# EAGLE design fakugesi_pass (EAGLE 7.5.0)
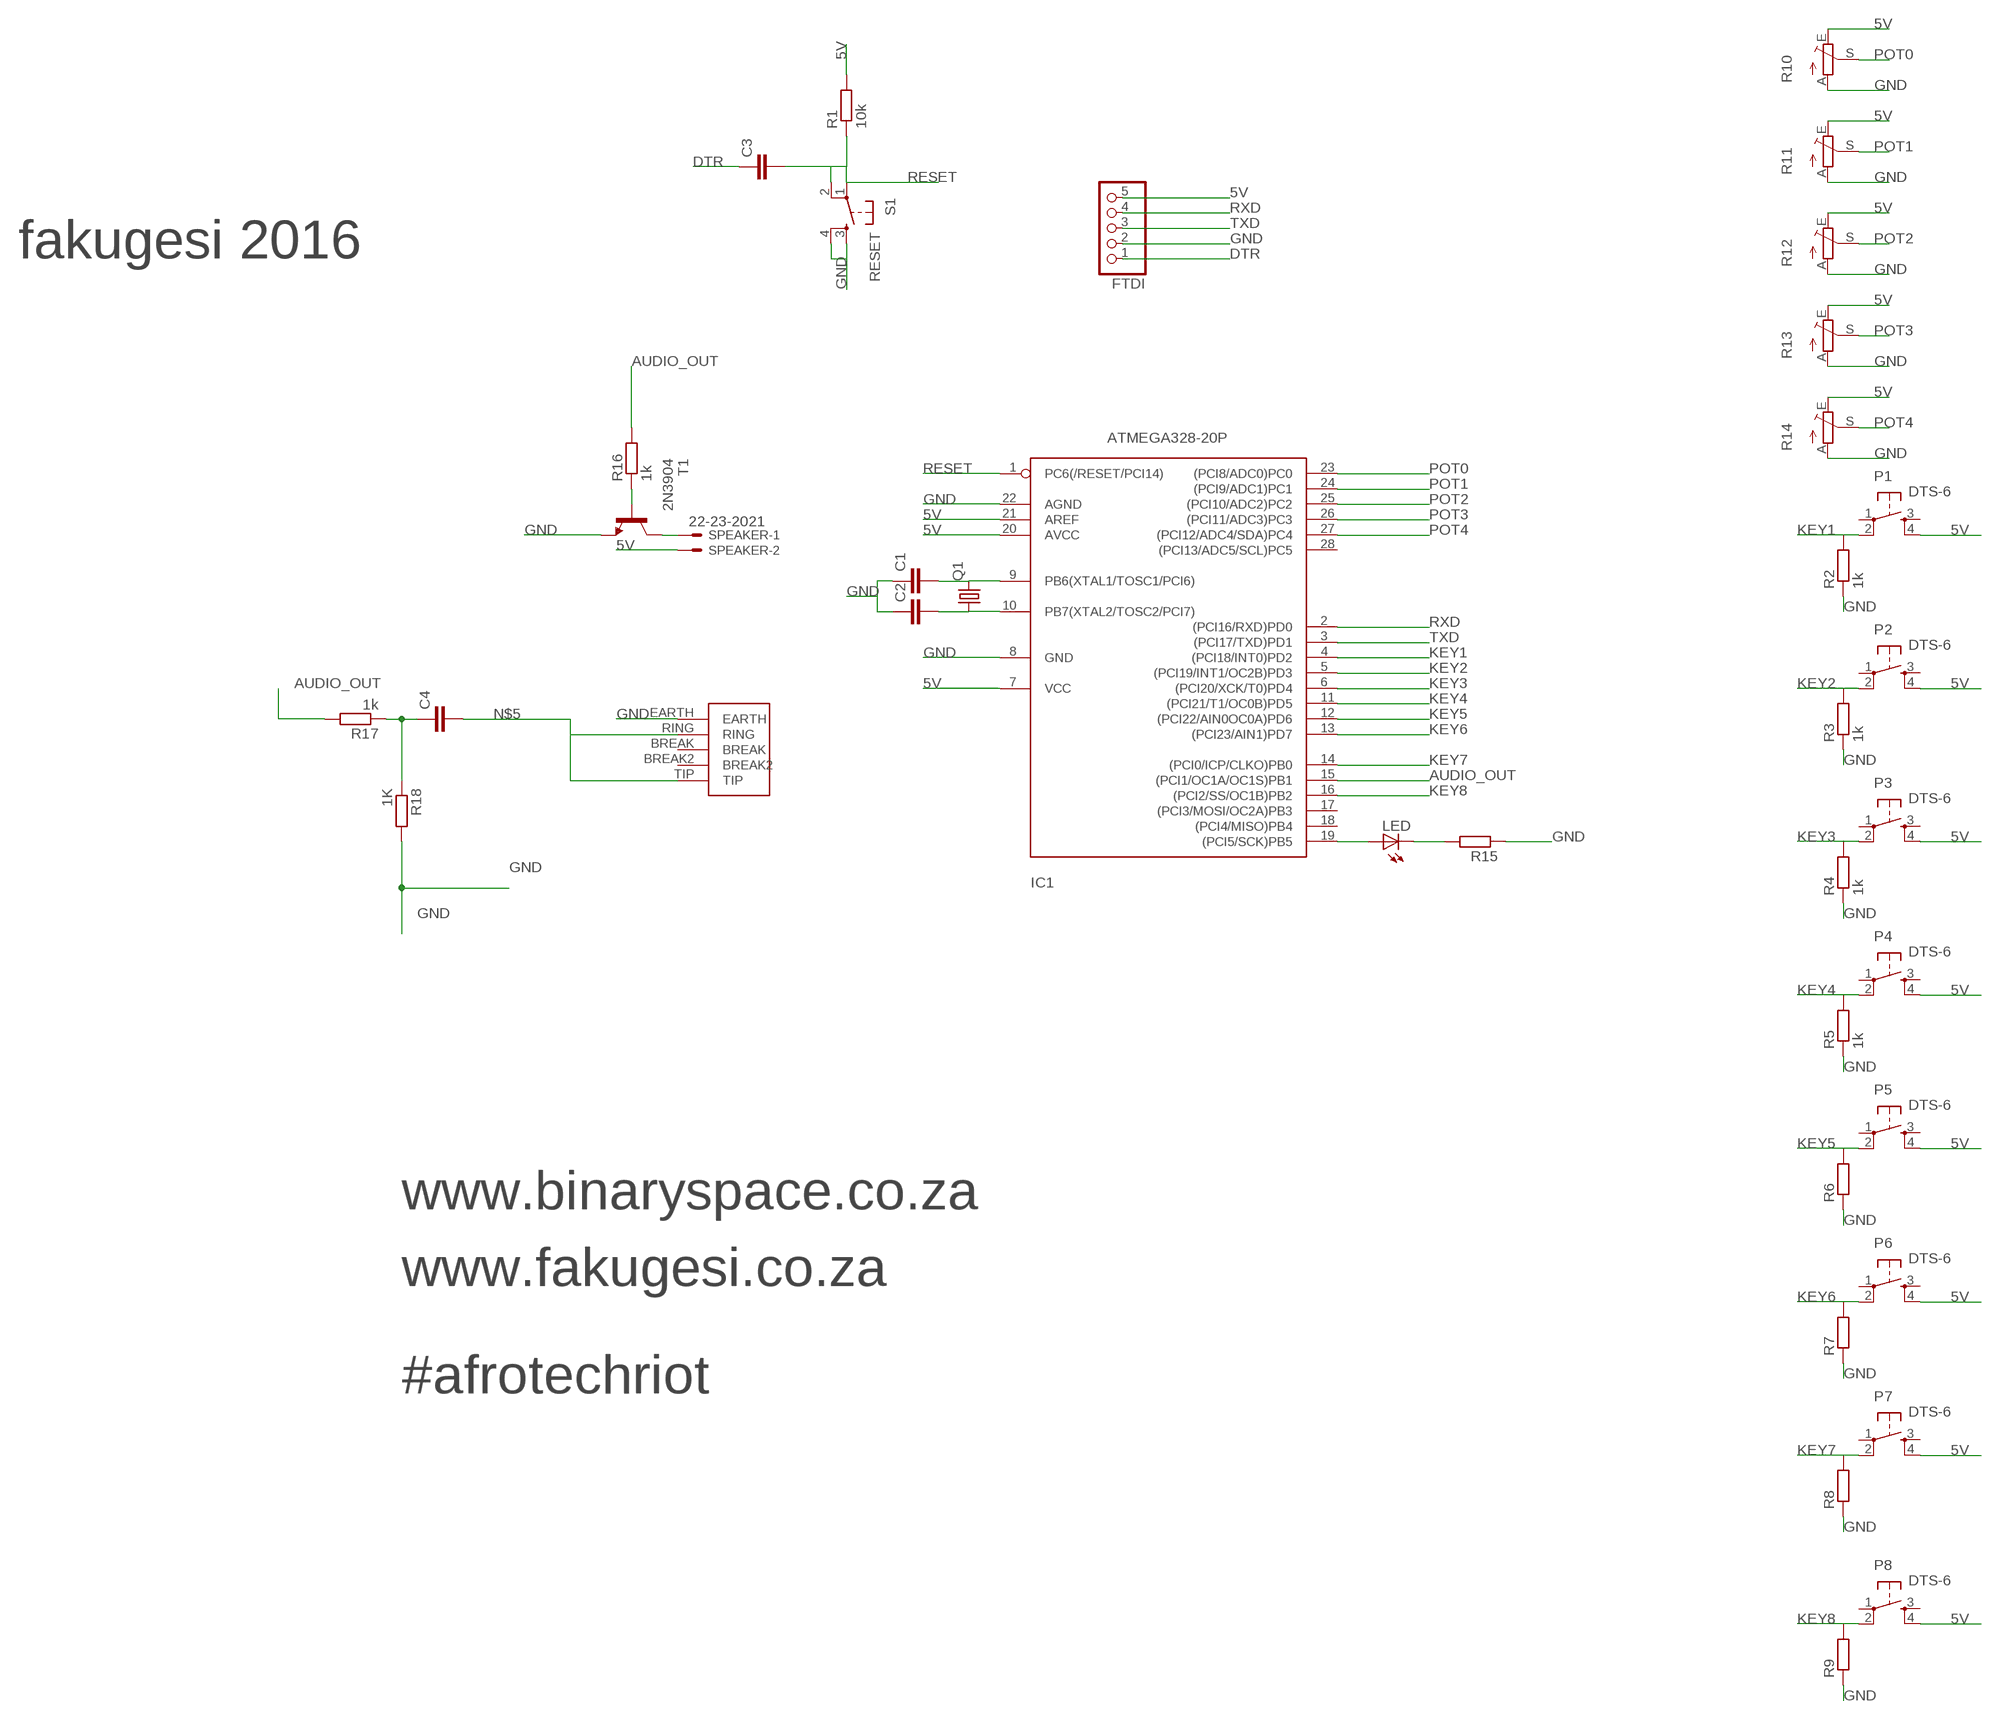
[diagram p0: schematic, sheet 1]

## Parts
C1  C2.5/5  [C2.5-5]
C2  C2.5/5  [C2.5-5]
C3  C2.5/5  [C2.5-5]
C4  C2.5/5  [C2.5-5]
FTDI  HEADER-1X5  [1X05_OVAL]
IC1  ATMEGA328-20P  [DIL28-3]
LED  LED3MM  [LED3MM]
P1  DTS-6  [DTS-6]
P2  DTS-6  [DTS-6]
P3  DTS-6  [DTS-6]
P4  DTS-6  [DTS-6]
P5  DTS-6  [DTS-6]
P6  DTS-6  [DTS-6]
P7  DTS-6  [DTS-6]
P8  DTS-6  [DTS-6]
Q1  CRYTALHC49S  [HC49/S]
R1  10k  R-EU_0207/7  [0207/7]
R2  1k  R-EU_0207/7  [0207/7]
R3  1k  R-EU_0207/7  [0207/7]
R4  1k  R-EU_0207/7  [0207/7]
R5  1k  R-EU_0207/7  [0207/7]
R6  R-EU_0207/7  [0207/7]
R7  R-EU_0207/7  [0207/7]
R8  R-EU_0207/7  [0207/7]
R9  R-EU_0207/7  [0207/7]
R10  TRIM_EU-RS3  [RS3]
R11  TRIM_EU-RS3  [RS3]
R12  TRIM_EU-RS3  [RS3]
R13  TRIM_EU-RS3  [RS3]
R14  TRIM_EU-RS3  [RS3]
R15  R-EU_0207/7  [0207/7]
R16  1k  R-EU_0207/7  [0207/7]
R17  1k  R-EU_0207/7  [0207/7]
R18  1K  R-EU_0207/7  [0207/7]
S1  RESET  DTS-6  [DTS-6]
SPEAKER  22-23-2021  [22-23-2021]
T1  2N3904  [TO92]
U$1  3.5MMAUDIOJACKPCB  [3.5MMAUDIOJACK]

## Nets
5V: FTDI.5 IC1.7(VCC) IC1.20(AVCC) IC1.21(AREF) P1.4 P2.4 P3.4 P4.4 P5.4 P6.4 P7.4 P8.4 R1.2 R10.E R11.E R12.E R13.E R14.E SPEAKER.2
AUDIO_OUT: IC1.15((PCI1/OC1A/OC1S)PB1) R16.2 R17.2
DTR: C3.1 FTDI.1
GND: C1.1 C2.1 FTDI.2 IC1.8(GND) IC1.22(AGND) R2.1 R3.1 R4.1 R5.1 R6.1 R7.1 R8.1 R9.1 R10.A R11.A R12.A R13.A R14.A R15.1 R18.2 S1.3 S1.4 T1.3(E) U$1.EARTH
KEY1: IC1.4((PCI18/INT0)PD2) P1.2 R2.2
KEY2: IC1.5((PCI19/INT1/OC2B)PD3) P2.2 R3.2
KEY3: IC1.6((PCI20/XCK/T0)PD4) P3.2 R4.2
KEY4: IC1.11((PCI21/T1/OC0B)PD5) P4.2 R5.2
KEY5: IC1.12((PCI22/AIN0OC0A)PD6) P5.2 R6.2
KEY6: IC1.13((PCI23/AIN1)PD7) P6.2 R7.2
KEY7: IC1.14((PCI0/ICP/CLKO)PB0) P7.2 R8.2
KEY8: IC1.16((PCI2/SS/OC1B)PB2) P8.2 R9.2
N$1: SPEAKER.1 T1.1(C)
N$2: C4.1 R17.1 R18.1
N$3: IC1.19((PCI5/SCK)PB5) LED.A
N$4: LED.K(C) R15.2
N$5: C4.2 U$1.RING U$1.TIP
N$7: R16.1 T1.2(B)
POT0: IC1.23((PCI8/ADC0)PC0) R10.S
POT1: IC1.24((PCI9/ADC1)PC1) R11.S
POT2: IC1.25((PCI10/ADC2)PC2) R12.S
POT3: IC1.26((PCI11/ADC3)PC3) R13.S
POT4: IC1.27((PCI12/ADC4/SDA)PC4) R14.S
RESET: C3.2 IC1.1(PC6(/RESET/PCI14)) R1.1 S1.1 S1.2
RXD: FTDI.4 IC1.2((PCI16/RXD)PD0)
TXD: FTDI.3 IC1.3((PCI17/TXD)PD1)
XTAL1: C1.2 IC1.9(PB6(XTAL1/TOSC1/PCI6)) Q1.2
XTAL2: C2.2 IC1.10(PB7(XTAL2/TOSC2/PCI7)) Q1.1
Unconnected: IC1.17((PCI3/MOSI/OC2A)PB3) IC1.18((PCI4/MISO)PB4) IC1.28((PCI13/ADC5/SCL)PC5) P1.1 P1.3 P2.1 P2.3 P3.1 P3.3 P4.1 P4.3 P5.1 P5.3 P6.1 P6.3 P7.1 P7.3 P8.1 P8.3 U$1.BREAK U$1.BREAK2

## Notes on the sheet
- fakugesi 2016
- www.binaryspace.co.za
- www.fakugesi.co.za
- #afrotechriot

## Library data of the parts
C1-C4 = capacitor-wima:C: CAPACITOR naming: grid - package width
FTDI = microbuilder:HEADER-1X5: PIN HEADER
IC1 = atmega328:ATMEGA328*P: MICROCONTROLLER 32 kBytes FLASH 2 kBytes SRAM 1 kBytes EEPROM USART 8-channel 10 bit ADC
LED = led:LED: LED OSRAM: - CHIPLED LG R971, LG N971, LY N971, LG Q971, LY Q971, LO R971, LY R971 LH N974, LH R974 LS Q976, LO Q976, LY Q976 LO Q996 - Hyper CHIPLED LW Q18S LB Q993, LB Q99A, LB R99A - SideLED LS A670, LO A670, LY A670, LG A670, LP A670 LB A673, LV A673, LT A673, LW A673 LH A674 LY A675 LS A676, LA A676, LO A676, LY A676, LW A676 LS A679, LY A679, LG A679 - Hyper Micro SIDELED® LS Y876, LA Y876, LO Y876, LY Y876 LT Y87S - SmartLED LW L88C, LW L88S LB L89C, LB L89S, LG L890 LS L89K, LO L89K, LY L89K LS L896, LA L896, LO L896, LY L896 - TOPLED LS T670, LO T670, LY T670, LG T670, LP T670 LSG T670, LSP T670, LSY T670, LOP T670, LYG T670 LG T671, LOG T671, LSG T671 LB T673, LV T673, LT T673, LW T673 LH T674 LS T676, LA T676, LO T676, LY T676, LB T676, LH T676, LSB T676, LW T676 LB T67C, LV T67C, LT T67C, LS T67K, LO T67K, LY T67K, LW E67C LS E67B, LA E67B, LO E67B, LY E67B, LB E67C, LV E67C, LT E67C LW T67C LS T679, LY T679, LG T679 LS T770, LO T770, LY T770, LG T770, LP T770 LB T773, LV T773, LT T773, LW T773 LH T774 LS E675, LA E675, LY E675, LS T675 LS T776, LA T776, LO T776, LY T776, LB T776 LHGB T686 LT T68C, LB T68C - Hyper Mini TOPLED® LB M676 - Mini TOPLED Santana® LG M470 LS M47K, LO M47K, LY M47K Source: http://www.osram.convergy.de LUXEON: - LUMILED® LXK2-PW12-R00, LXK2-PW12-S00, LXK2-PW14-U00, LXK2-PW14-V00 LXK2-PM12-R00, LXK2-PM12-S00, LXK2-PM14-U00 LXK2-PE12-Q00, LXK2-PE12-R00, LXK2-PE12-S00, LXK2-PE14-T00, LXK2-PE14-U00 LXK2-PB12-K00, LXK2-PB12-L00, LXK2-PB12-M00, LXK2-PB14-N00, LXK2-PB14-P00, LXK2-PB14-Q00 LXK2-PR12-L00, LXK2-PR12-M00, LXK2-PR14-Q00, LXK2-PR14-R00 LXK2-PD12-Q00, LXK2-PD12-R00, LXK2-PD12-S00 LXK2-PH12-R00, LXK2-PH12-S00 LXK2-PL12-P00, LXK2-PL12-Q00, LXK2-PL12-R00 Source: www.luxeon.com KINGBRIGHT: KA-3528ASYC Source: www.kingbright.com
P1-P8 S1 = switch-tact:DTS-6
Q1 = crystal:CRYTAL: CRYSTAL
R1-R9 R16-R18 = resistor:R-EU_: RESISTOR, European symbol
R10-R14 = pot:TRIM_EU-: POTENTIOMETER
R15 = rcl:R-EU_: RESISTOR, European symbol
SPEAKER = con-molex:22-23-2021: .100" (2.54mm) Center Header - 2 Pin; MF: MOLEX; MPN: 22-23-2021; OC_FARNELL: 1462926; OC_NEWARK: 25C3832
T1 = transistor:2N3904: NPN TRANSISTOR
U$1 = protofactory:3.5MMAUDIOJACK: Stereo Audio Jack Mantech: 72M1126

## Board
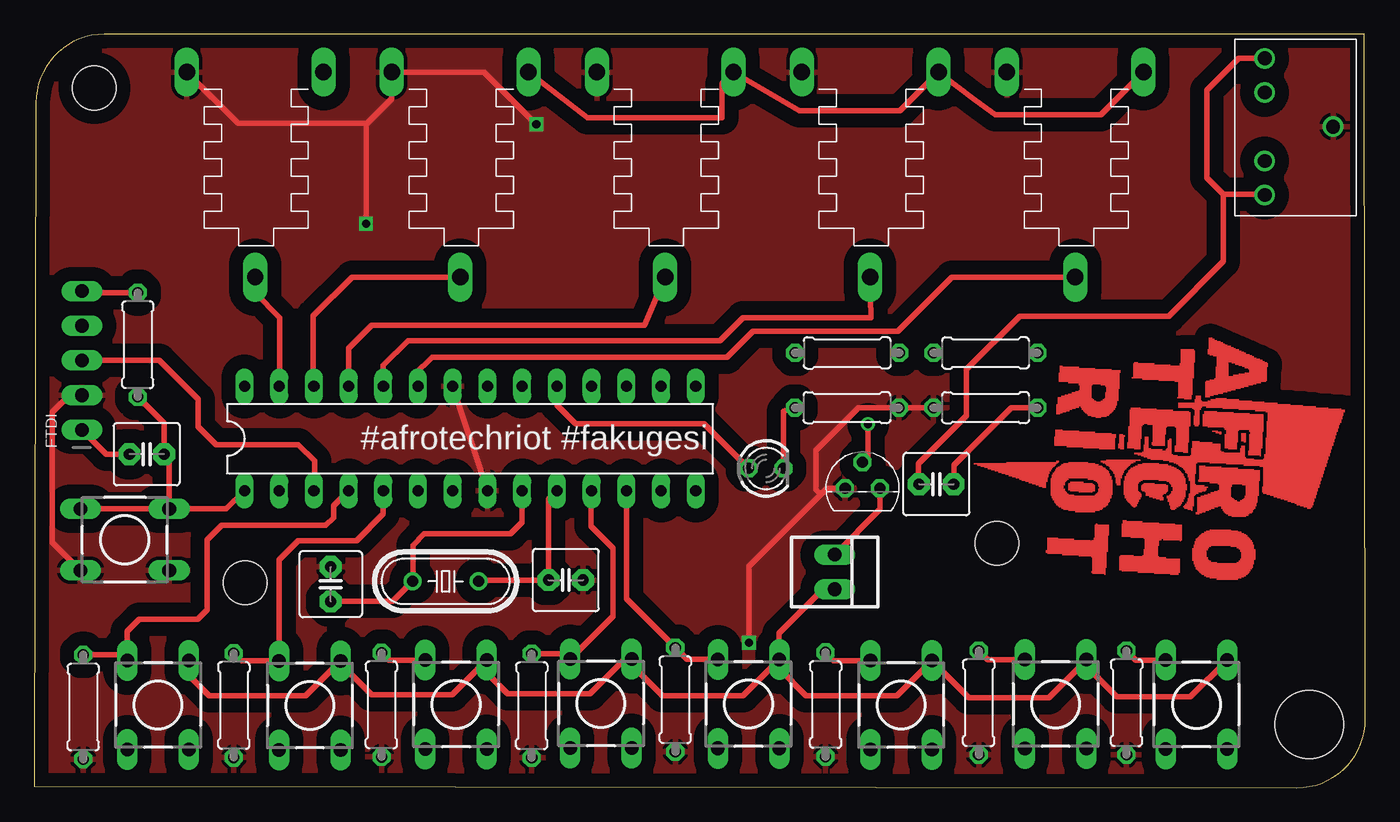
[diagram p1: board, top side]
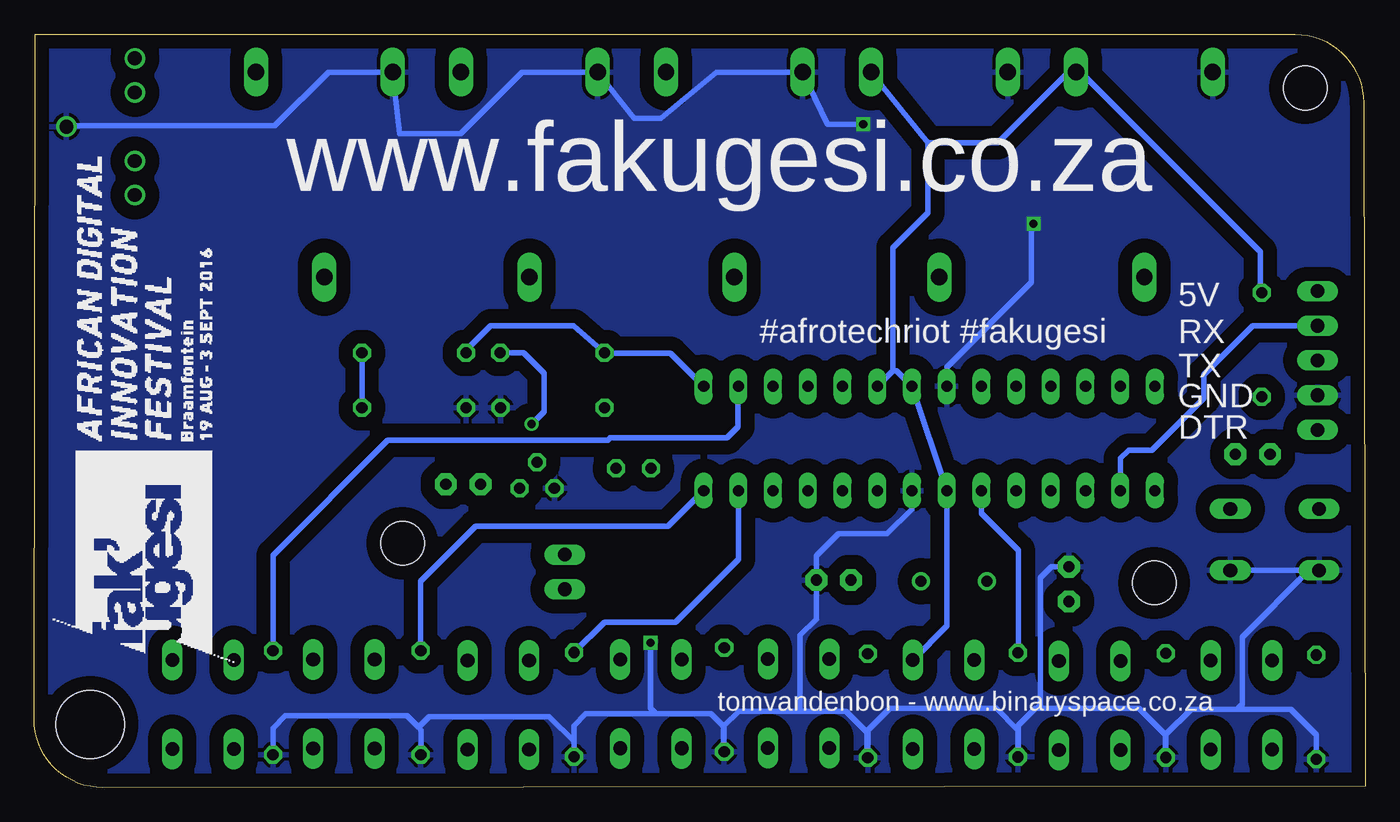
[diagram p2: board, bottom side, seen from below]

Size 97.4 x 55.11 mm. Coordinates in mm from the lower left corner, seen from the top.
Outline: 97.4,5.01 97.31,55.11 5.14,55.1 arc90 0.13,50.09 0,0.09 92.39,0 arc90 97.4,5.01
Copper layers (1*16): Top 0.035mm / dielectric 1.5mm / Bottom 0.035mm
Design rules "default *": minimum track width 20mil, minimum drill 24mil, track to track 8mil, track to pad 8mil, pad to pad 8mil, via to via 8mil, smd to smd 8mil, copper to edge 40mil, drill to drill 8mil, minimum pad ring 10mil, minimum via ring 8mil, stop-mask expansion 4mil, vias tented up to drill 0mil, thermal gap 10mil
Holes 5 mm at 93.3,4.63
Holes 3.2 mm at 4.4,51.18 70.45,17.88 15.45,14.98

### Footprints (pad centres in the part's own frame; a part is rotated, then mirrored left to right if it is on the bottom)
C2.5-5 = drill 0.813 pad 1.6 octagon: 1 -1.27,0; 2 1.27,0
1X05_OVAL = drill 1 long: 1 -5.08,0; 2 -2.54,0; 3 0,0; 4 2.54,0; 5 5.08,0
DIL28-3 = drill 0.813 long: 1 -16.51,-3.81; 2 -13.97,-3.81; 3 -11.43,-3.81; 4 -8.89,-3.81; 5 -6.35,-3.81; 6 -3.81,-3.81; 7 -1.27,-3.81; 8 1.27,-3.81; 9 3.81,-3.81; 10 6.35,-3.81; 11 8.89,-3.81; 12 11.43,-3.81; 13 13.97,-3.81; 14 16.51,-3.81; 15 16.51,3.81; 16 13.97,3.81; 17 11.43,3.81; 18 8.89,3.81; 19 6.35,3.81; 20 3.81,3.81; 21 1.27,3.81; 22 -1.27,3.81; 23 -3.81,3.81; 24 -6.35,3.81; 25 -8.89,3.81; 26 -11.43,3.81; 27 -13.97,3.81; 28 -16.51,3.81
LED3MM = drill 0.813 octagon: A -1.27,0; K 1.27,0
DTS-6 = drill 1 long: 1 -3.25,2.25; 2 3.25,2.25; 3 -3.25,-2.25; 4 3.25,-2.25
HC49/S = drill 0.813: 1 -2.413,0; 2 2.413,0
0207/7 = drill 0.813 octagon: 1 -3.81,0; 2 3.81,0
RS3 = drill 1.2 long: A -2.54,2.54; E 7.46,2.54; S 2.46,-12.46
22-23-2021 = drill 1 long: 1 -1.27,0; 2 1.27,0
TO92 = drill 0.813 octagon: 1 1.27,0; 2 0,1.905; 3 -1.27,0
3.5MMAUDIOJACK = drill 1: BREAK 2.5,0; BREAK2 -2.5,0; EARTH 0,5; RING 5,0; TIP -5,0

### Placement (x,y rotation side)
C1  21.7,14.89 270 top
C2  38.9,15.19 180 top
C3  8.24,24.4 0 top
C4  66.01,22.2 180 top
FTDI  3.49,31.25 90 top
IC1  31.9,25.54 0 top
LED  53.55,23.36 0 top
P1  9.07,6.05 90 top
P2  20.17,6.02 90 top
P3  30.87,6.09 90 top
P4  41.47,6.16 90 top
P5  52.27,6.13 90 top
P6  63.44,6.05 90 top
P7  74.74,6.12 90 top
P8  85.04,6.09 90 top
Q1  30.11,15.09 180 top
R1  7.58,32.4 90 top
R2  3.59,5.9 90 top
R3  14.61,6.02 90 top
R4  25.41,6.06 90 top
R5  36.41,6 90 top
R6  46.91,6.44 90 top
R7  57.91,6.08 90 top
R8  69.11,6.22 90 top
R9  79.93,6.22 90 top
R10  73.71,49.8 0 top
R11  58.71,49.8 0 top
R12  43.71,49.8 0 top
R13  28.71,49.8 0 top
R14  13.71,49.8 0 top
R15  59.47,27.8 180 top
R16  59.49,31.8 180 top
R17  69.61,31.8 180 top
R18  69.61,27.8 180 top
S1  6.63,18.14 0 top
SPEAKER  58.58,15.78 270 top
T1  60.61,21.9 0 top
U$1  90.04,48.35 270 top

### Tracks (layer width: path | path; a pad name or v marks a point on that pad's centre or on a via)
5V
  Top 0.406: R13.E 40.5,49.01 50.32,49.01 50.32,51.49 R12.E 56.01,49.5 63.33,49.5 R11.E 68.87,50.29 70.34,49.22 78.05,49.22 R10.E | FTDI.5 3.61,36.21 R1.2 | P8.4 84.61,6.66 79.23,6.66 76.99,8.9 P7.4 76.99,9.32 74.26,6.59 68.4,6.59 P6.4 63.12,6.73 56.48,6.73 54.52,8.69 P5.4 | P5.4 51.87,6.73 45.98,6.73 43.72,8.99 P4.4 43.2,9.41 40.66,6.87 34.64,6.87 33.1,8.41 33.1,9.32 P3.4 30.58,6.8 24.7,6.8 22.42,9.08 P2.4 19.88,6.73 12.8,6.73 11.32,8.21 P1.4 | SPEAKER.2 57.72,14.51 54.51,11.3 P5.4
  Bottom 0.406: P3.4 30.63,11.83 IC1.7 IC1.21 34.31,30.49 34.57,30.49 | R1.2 7.69,36.32 7.69,39.21 20.82,52.34 R14.E 21.72,52.34 26.87,47.19 32.02,47.19 | 32.02,47.19 R13.E | 32.02,47.19 32.02,42.04 34.57,39.49 34.57,30.49 | 34.57,30.49 IC1.20
AUDIO_OUT
  Bottom 0.406: IC1.15 50.85,31.79 55.43,31.79 R16.2 57.94,33.8 64.01,33.8 65.8,32.01 R17.2
DTR
  Top 0.406: FTDI.1 5.26,24.4 C3.1
GND  (via drill 0.6)
  Top 0.406: FTDI.2 2.58,28.71 1.32,27.45 1.32,17.95 S1.3 | R14.A 14.92,48.59 24.21,48.59 24.28,48.52 | v24.28,41.24 24.28,48.52 | IC1.22 IC1.8 | v36.74,48.52 32.92,52.34 R13.A 26.17,50.41 24.28,48.52 | T1.3 58.01,21.9 57.56,21.45 | 57.56,21.45 52.31,16.2 v52.31,10.6 | R18.2 R15.1 60.31,27.8 57.21,24.7 57.21,21.8 57.56,21.45
  Bottom 0.406: R2.1 3.59,3.89 5.45,5.75 9.37,5.75 | 9.37,5.75 12.73,5.75 14.62,3.86 R3.1 14.61,3.85 16.58,5.82 24,5.82 | 24,5.82 24.14,5.82 25.4,4.56 R4.1 25.41,4.22 27.01,5.82 34.78,5.82 36.41,4.19 R5.1 36.46,2.24 36.46,4.07 38,5.61 41.5,5.61 | 41.5,5.61 45.84,5.61 46.91,4.54 R6.1 46.96,2.68 46.96,4.49 47.87,5.4 51.91,5.4 | 51.91,5.4 57.04,5.4 57.91,4.53 R7.1 57.91,3.4 59.71,5.2 68.51,5.2 69.29,4.42 | R8.1 69.08,2.44 69.08,4.21 69.29,4.42 | 69.29,4.42 70.13,5.26 79.02,5.26 79.93,4.35 R9.1 | 9.37,5.75 9.02,6.1 9.02,11 4.13,15.89 S1.3 S1.4 | IC1.22 30.63,30.76 24.42,36.97 24.42,41.1 v24.28,41.24 | IC1.8 33.17,20.38 34.99,18.56 38.56,18.56 40.17,16.95 C2.1 40.17,12.33 41.36,11.14 41.36,5.75 41.5,5.61 | C1.1 22.97,16.16 23.79,15.34 23.79,6.03 24,5.82 | v36.74,48.52 39.35,48.52 R12.A 47.48,52.34 51.55,48.97 53.5,48.97 R11.A 61.69,52.34 66.21,47.82 70.65,47.82 R10.A 75.87,52.34 79.81,48.4 94.99,48.4 U$1.EARTH | v52.31,10.6 52.31,5.8 51.91,5.4
  pour Top (isolate 1.016): -2.79,56.5 99.01,56.5 99.01,-1.8 -2.79,-1.8
  pour Bottom (isolate 1.016): -2.29,58.3 101.21,58.3 101.21,-1.5 -2.39,-1.5 -2.39,58.3
KEY1
  Top 0.406: IC1.4 21.9,20.62 21.9,19.75 21.34,19.19 13.71,19.19 12.66,18.14 12.66,13.03 11.96,12.33 7.69,12.33 6.82,11.46 P1.2 6.41,9.71 R2.2
KEY2
  Top 0.406: R3.2 15.17,9.27 P2.2 17.91,16.67 19.31,18.07 23.58,18.07 25.55,20.04 IC1.5
KEY3
  Top 0.406: R4.2 25.94,9.34 P3.2
  Bottom 0.406: IC1.6 28.09,20.06 25.4,17.37 R4.2
KEY4
  Top 0.406: IC1.11 40.79,21.42 40.73,21.36 40.73,19.12 42.34,17.51 42.34,12.53 P4.2 38.82,9.81 R5.2
KEY5
  Top 0.406: IC1.12 43.33,13.83 R6.2 47.78,9.38 P5.2
KEY6
  Top 0.406: R7.2 58.5,9.3 P6.2
  Bottom 0.406: IC1.13 45.87,16.71 50.46,12.12 55.68,12.12 R7.2
KEY7
  Top 0.406: R8.2 69.77,9.37 P7.2
  Bottom 0.406: IC1.14 51.02,19.12 65.09,19.12 69.11,15.1 R8.2
KEY8
  Top 0.406: R9.2 80.62,9.34 P8.2
  Bottom 0.406: R9.2 79.93,17.02 71.53,25.42 55.43,25.42 55.25,25.6 46.71,25.6 45.91,26.4 45.91,29.35 IC1.16
N$1
  Top 0.406: T1.1 61.88,20.35 SPEAKER.1
N$2
  Top 0.406: R18.1 71.51,27.8 67.31,23.6 67.31,22.23 C4.1
  Bottom 0.406: R18.1 R17.1
N$3
  Top 0.406: IC1.19 38.25,27.97 39.61,26.61 49.03,26.61 LED.A
N$4
  Top 0.406: LED.K 54.82,27.54 R15.2
N$5
  Top 0.406: U$1.TIP 88.16,53.35 85.81,51 85.81,44.6 87.01,43.4 | 87.01,43.4 89.99,43.4 U$1.RING | 87.01,43.4 87.01,38.5 83.01,34.5 72.11,34.5 68.21,30.6 68.21,27.2 64.71,23.7 64.71,22.23 C4.2
N$7  (via drill 0.6)
  Top 0.406: v61.01,26.6 61.01,24.2 T1.2
  Bottom 0.406: R16.1 61.61,31.8 60.11,30.3 60.11,27.5 v61.01,26.6
POT0
  Top 0.406: R10.S 67.15,37.34 63.21,33.4 52.61,33.4 50.71,31.5 29.11,31.5 27.81,30.2 27.81,29.63 IC1.23
POT1
  Top 0.406: R11.S 61.21,34.38 51.86,34.38 50.18,32.7 27.36,32.7 25.55,30.89 IC1.24
POT2
  Top 0.406: R12.S 44.65,33.82 24.7,33.82 23.01,32.13 IC1.25
POT3
  Top 0.406: IC1.26 20.43,29.39 20.43,34.52 23.25,37.34 R13.S
POT4
  Top 0.406: IC1.27 17.98,29.4 17.98,34.38 16.17,36.19 R14.S
RESET
  Top 0.406: S1.1 S1.2 | IC1.1 14.05,20.39 S1.2 | R1.1 9.51,26.66 C3.2 9.88,24.03 S1.2
RXD
  Bottom 0.406: FTDI.4 8.22,33.79 11.81,30.2 11.81,28.5 15.61,24.7 17.31,24.7 17.91,24.1 17.91,21.75 IC1.2
TXD
  Top 0.406: FTDI.3 9.16,31.25 12.01,28.4 12.01,26.4 13.31,25.1 19.31,25.1 20.51,23.9 20.51,21.77 IC1.3
XTAL1
  Top 0.406: C1.2 26.23,13.62 Q1.2 27.71,15.1 27.71,17.72 28.55,18.56 34.85,18.56 35.71,19.42 IC1.9
XTAL2
  Top 0.406: IC1.10 37.63,21.11 C2.2 32.62,15.19 Q1.1
(copper drawn outside any net)
  shapes: Top area x971

### Text on the board
tNames: #afrotechriot #fakugesi
bNames: www.fakugesi.co.za | 5V | #afrotechriot #fakugesi | RX | TX | GND | DTR | tomvandenbon - www.binaryspace.co.za